# EAGLE design motor_controller_single (EAGLE 7.5.0)
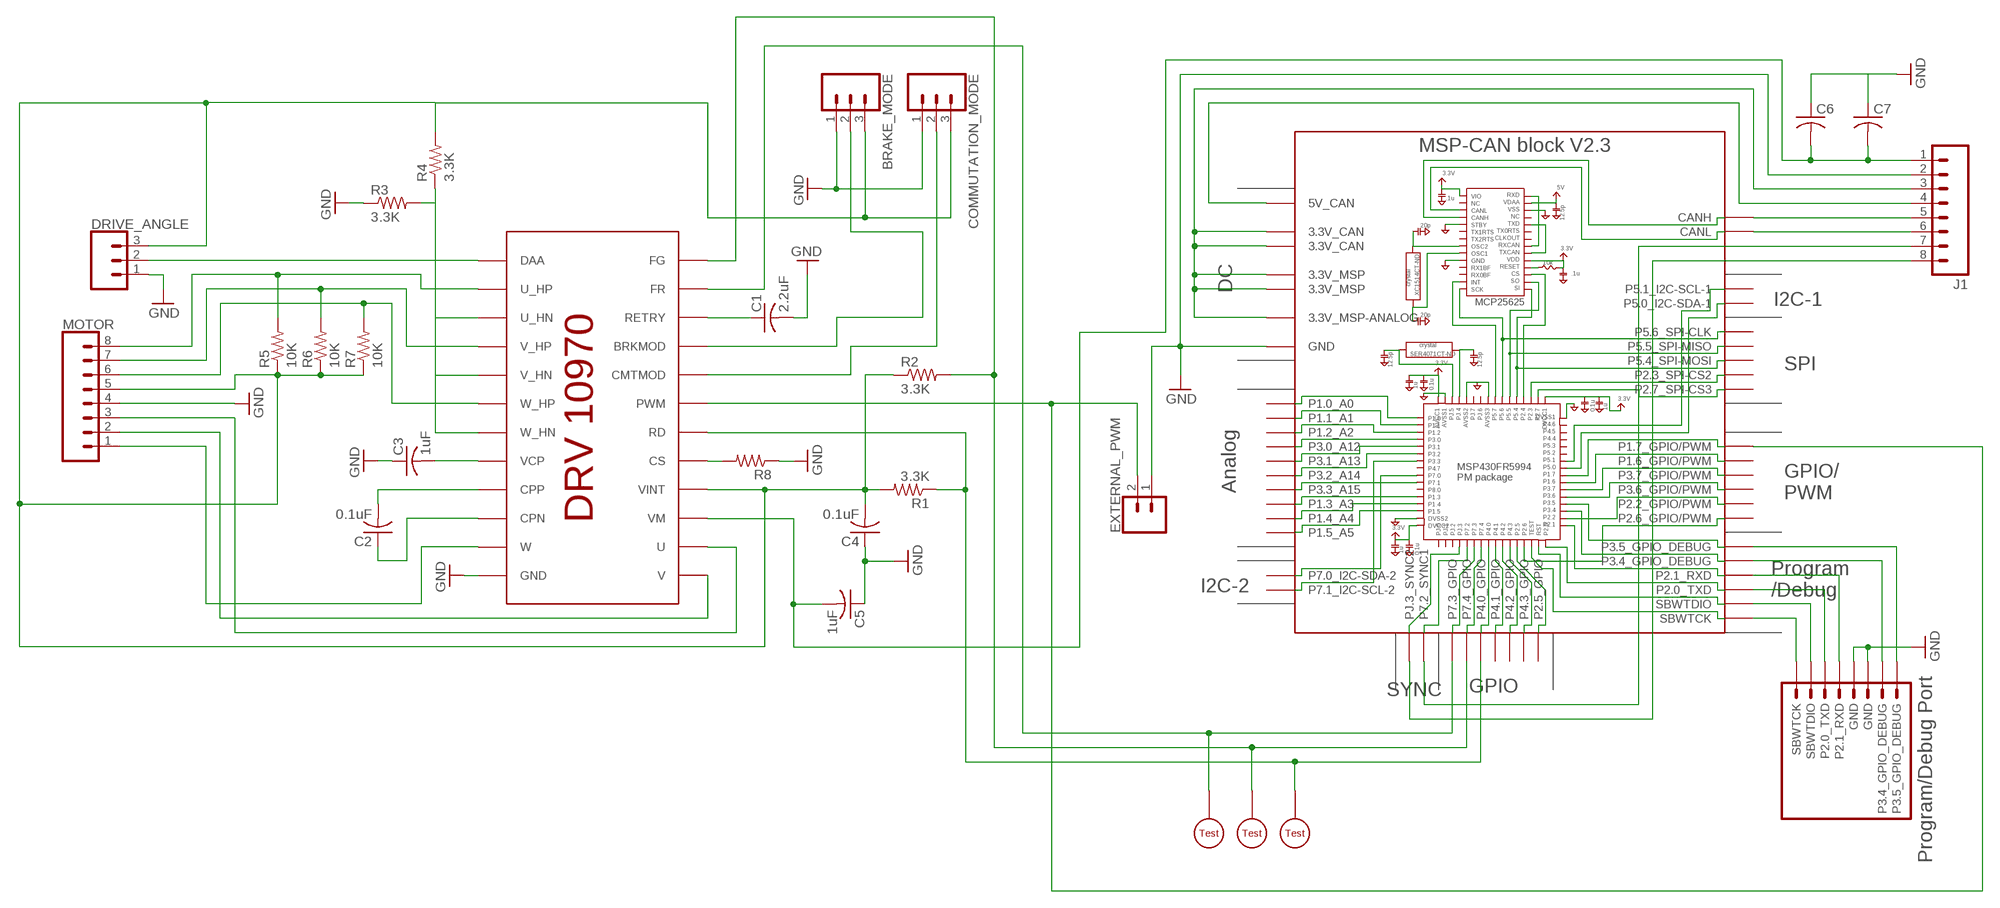
[diagram p0: schematic, sheet 1]

## Parts
BRAKE_MODE  CONN_03LOCK  [1X03_LOCK]
C1  2.2uF  C-USC1206  [C1206]
C2  0.1uF  C-USC0805  [C0805]
C3  1uF  C-USC1206  [C1206]
C4  0.1uF  C-USC0805  [C0805]
C5  1uF  C-USC1206  [C1206]
C6  C-USC0805  [C0805]
C7  C-USC0805  [C0805]
COMMUTATION_MODE  CONN_03LOCK  [1X03_LOCK]
DRIVE_ANGLE  CONN_03LOCK  [1X03_LOCK]
EXTERNAL_PWM  CONN_02LOCK  [1X02_LOCK]
J1  M08LOCK  [1X08_LOCK]
MOTOR  CONN_08"  [1X08@1]
R1  3.3K  R-US_R0805  [R0805]
R2  3.3K  R-US_R0805  [R0805]
R3  3.3K  R-US_R0805  [R0805]
R4  3.3K  R-US_R0805  [R0805]
R5  10K  R-US_R0805  [R0805]
R6  10K  R-US_R0805  [R0805]
R7  10K  R-US_R0805  [R0805]
R8  R-US_R0805  [R0805]
U$1  DRV10970  [DRV10970]
U$2  MSP-CAN_BLOCK  [MSP-CAN_BLOCK]
U$3  PROGRAM/DEBUG_PORT  [1X08_CONNECTOR]
U$4  KEYSTONE_SMD_TEST_POINT  [KEYSTONE_SMD_TEST_POINT]
U$5  KEYSTONE_SMD_TEST_POINT  [KEYSTONE_SMD_TEST_POINT]
U$6  KEYSTONE_SMD_TEST_POINT  [KEYSTONE_SMD_TEST_POINT]

## Nets
GND: BRAKE_MODE.1 C1.2 C3.1 C4.1 C5.1 C6.1 C7.1 COMMUTATION_MODE.1 DRIVE_ANGLE.1 EXTERNAL_PWM.1 J1.2 MOTOR.4 R3.1 R8.1 U$1.GND@1(GND) U$1.GND@2(GND) U$2.GND@1(GND) U$2.GND@2(GND) U$2.GND@3(GND) U$2.GND@4(GND) U$2.GND@5(GND) U$2.GND@7(GND) U$2.GND@8(GND) U$2.GND@9(GND) U$2.GND@10(GND) U$2.GND@11(GND) U$2.GND@12(GND) U$2.GND@13(GND) U$2.GND@14(GND) U$2.GND@15(GND) U$2.GND@16(GND) U$2.GND@17(GND) U$2.GND@26(GND) U$3.5(GND) U$3.6(GND)
N$1: C2.2 U$1.CPP
N$2: C1.1 U$1.RETRY
N$3: U$2.SBWTCK U$3.SBWTCK
N$4: U$2.SBWTDIO U$3.2(SBWTDIO)
N$5: U$2.P2.0_TXD U$3.3(P2.0_TXD)
N$6: U$2.P2.1_RXD U$3.4(P2.1_RXD)
N$7: U$2.P3.4_GPIO_DEBUG U$3.7(P3.4_GPIO_DEBUG)
N$8: U$2.P3.5_GPIO_DEBUG U$3.8(P3.5_GPIO_DEBUG)
N$9: R1.1 U$1.RD U$2.P4.0_GPIO U$6.P$1
N$10: EXTERNAL_PWM.2 U$1.PWM U$2.P1.7_GPIO/PWM
N$11: R2.2 U$1.FG U$2.P7.4_GPIO U$5.P$1
N$12: U$1.FR U$2.P7.3_GPIO U$4.P$1
N$13: C2.1 U$1.CPN
N$14: J1.6 U$2.CANL
N$15: C3.2 U$1.VCP
N$16: C5.2 C6.2 C7.2 J1.1 U$1.VM
N$17: R3.2 R4.1 U$1.U_HN U$1.V_HN U$1.W_HN
N$18: DRIVE_ANGLE.2 U$1.DAA
N$19: COMMUTATION_MODE.2 U$1.CMTMOD
N$20: BRAKE_MODE.2 U$1.BRKMOD
N$21: BRAKE_MODE.3 C4.2 COMMUTATION_MODE.3 DRIVE_ANGLE.3 MOTOR.5 R1.2 R2.1 R4.2 R5.1 R6.1 R7.1 U$1.VINT
N$22: J1.5 U$2.CANH
N$23: J1.4 U$2.5V(5V_CAN)
N$24: J1.3 U$2.3.3V@CAN1(3.3V_CAN) U$2.3.3V@CAN2(3.3V_CAN) U$2.3.3V@MSP1(3.3V_MSP) U$2.3.3V@MSP2(3.3V_MSP) U$2.3.3V_ANALOG@MSP2(3.3V_MSP-ANALOG)
N$25: R8.2 U$1.CS
N$26: MOTOR.1 U$1.W
N$27: MOTOR.6 R7.2 U$1.W_HP
N$28: MOTOR.7 R6.2 U$1.V_HP
N$29: MOTOR.8 R5.2 U$1.U_HP
N$30: MOTOR.2 U$1.V
N$34: MOTOR.3 U$1.U
SYNC1: J1.7 U$2.P7.2_SYNC1
SYNC2: J1.8 U$2.PJ.3_SYNC2
Unconnected: U$2.P1.0_A0 U$2.P1.1_A1 U$2.P1.2_A2 U$2.P1.3_A3 U$2.P1.4_A4 U$2.P1.5_A5 U$2.P1.6_GPIO/PWM U$2.P2.2_GPIO/PWM U$2.P2.4_SPI-CS2(P2.3_SPI-CS2) U$2.P2.5_GPIO U$2.P2.6_GPIO/PWM U$2.P2.7_SPI-CS3 U$2.P3.0_A12 U$2.P3.1_A13 U$2.P3.2_A14 U$2.P3.3_A15 U$2.P3.6_GPIO/PWM U$2.P3.7_GPIO/PWM U$2.P4.1_GPIO U$2.P4.2_GPIO U$2.P4.3_GPIO U$2.P5.0_I2C-SDA-1 U$2.P5.1_I2C-SCL-1 U$2.P5.4_SPI-MOSI U$2.P5.5_SPI-MISO U$2.P5.6_SPI-CLK U$2.P7.0_I2C-SDA-2 U$2.P7.1_I2C-SCL-2

## Library data of the parts
BRAKE_MODE COMMUTATION_MODE DRIVE_ANGLE = SparkFun-Connectors:CONN_03: Multi connection point. Often used as Generic Header-pin footprint for 0.1 inch spaced/style header connections On any of the 0.1 inch spaced packages, you can populate with these: Break Away Headers - Straight <https://www.sparkfun.com/products/116> (PRT-00116) Break Away Male Headers - Right Angle <https://www.sparkfun.com/products/553> (PRT-00553) Female Headers <https://www.sparkfun.com/products/115> (PRT-00115) Break Away Headers - Machine Pin <https://www.sparkfun.com/products/117> (PRT-00117) Break Away Female Headers - Swiss Machine Pin <https://www.sparkfun.com/products/743> (PRT-00743) Stackable Header - 3 Pin (Female, 0.1") <https://www.sparkfun.com/products/13875> (PRT-13875) For SCREWTERMINALS and SPRING TERMINALS visit here: Screw Terimnals on SparkFun.com <https://www.sparkfun.com/search/results?term=Screw+Terminals> (5mm/3.5mm/2.54mm spacing) This device is also useful as a general connection point to wire up your design to another part of your project. Our various solder wires solder well into these plated through hole pads. Hook-Up Wire - Assortment (Stranded, 22 AWG) <https://www.sparkfun.com/products/11375> (PRT-11375) Hook-Up Wire - Assortment (Solid Core, 22 AWG) <https://www.sparkfun.com/products/11367> (PRT-11367) View the entire wire category on our website here <https://www.sparkfun.com/categories/141> Special notes: Molex polarized connector foot print use with SKU : PRT-08232 with associated crimp pins and housings.
C1-C7 = rcl:C-US: CAPACITOR, American symbol
EXTERNAL_PWM = SparkFun-Connectors:CONN_02: Multi connection point. Often used as Generic Header-pin footprint for 0.1 inch spaced/style header connections On any of the 0.1 inch spaced packages, you can populate with these: Break Away Headers - Straight <https://www.sparkfun.com/products/116> (PRT-00116) Break Away Male Headers - Right Angle <https://www.sparkfun.com/products/553> (PRT-00553) Female Headers <https://www.sparkfun.com/products/115> (PRT-00115) Break Away Headers - Machine Pin <https://www.sparkfun.com/products/117> (PRT-00117) Break Away Female Headers - Swiss Machine Pin <https://www.sparkfun.com/products/743> (PRT-00743) For SCREWTERMINALS and SPRING TERMINALS visit here: Screw Terimnals on SparkFun.com <https://www.sparkfun.com/search/results?term=Screw+Terminals> (5mm/3.5mm/2.54mm spacing) This device is also useful as a general connection point to wire up your design to another part of your project. Our various solder wires solder well into these plated through hole pads. Hook-Up Wire - Assortment (Stranded, 22 AWG) <https://www.sparkfun.com/products/11375> (PRT-11375) Hook-Up Wire - Assortment (Solid Core, 22 AWG) <https://www.sparkfun.com/products/11367> (PRT-11367) View the entire wire category on our website here <https://www.sparkfun.com/categories/141> Special notes: Molex polarized connector foot print use with: PRT-08233 with associated crimp pins and housings. 2.54_SCREWTERM for use with PRT-10571. 3.5mm Screw Terminal footprints for PRT-08084 5mm Screw Terminal footprints for use with PRT-08432
J1 = SparkFun-Connectors:M08: Header 8 Standard 8-pin 0.1" header. Use with straight break away headers (SKU : PRT-00116), right angle break away headers (PRT-00553), swiss pins (PRT-00743), machine pins (PRT-00117), and female headers (PRT-00115).
MOTOR = SparkFun-Connectors:CONN_08: Multi connection point. Often used as Generic Header-pin footprint for 0.1 inch spaced/style header connections On any of the 0.1 inch spaced packages, you can populate with these: Break Away Headers - Straight <https://www.sparkfun.com/products/116> (PRT-00116) Break Away Male Headers - Right Angle <https://www.sparkfun.com/products/553> (PRT-00553) Female Headers <https://www.sparkfun.com/products/115> (PRT-00115) Break Away Headers - Machine Pin <https://www.sparkfun.com/products/117> (PRT-00117) Break Away Female Headers - Swiss Machine Pin <https://www.sparkfun.com/products/743> (PRT-00743) Arduino Stackable Header - 8 Pin <https://www.sparkfun.com/products/9279> (PRT-09279) For SCREWTERMINALS and SPRING TERMINALS visit here: Screw Terimnals on SparkFun.com <https://www.sparkfun.com/search/results?term=Screw+Terminals> (5mm/3.5mm/2.54mm spacing) This device is also useful as a general connection point to wire up your design to another part of your project. Our various solder wires solder well into these plated through hole pads. Hook-Up Wire - Assortment (Stranded, 22 AWG) <https://www.sparkfun.com/products/11375> (PRT-11375) Hook-Up Wire - Assortment (Solid Core, 22 AWG) <https://www.sparkfun.com/products/11367> (PRT-11367) View the entire wire category on our website here <https://www.sparkfun.com/categories/141> Special notes: Molex polarized connector foot print use with SKU : PRT-08231 with associated crimp pins and housings. 1MM SMD Version SKU: PRT-10208 NOTES ON THE VARIANTS LOCK and LOCK_LONGPADS... This footprint was designed to help hold the alignment of a through-hole component (i.e. 6-pin header) while soldering it into place. You may notice that each hole has been shifted either up or down by 0.005 of an inch from it's more standard position (which is a perfectly straight line). This slight alteration caused the pins (the squares in the middle) to touch the edges of the holes. Because they are alternating, it causes a "brace" to hold the component in place. 0.005 has proven to be the perfect amount of "off-center" position when using our standard breakaway headers. Although looks a little odd when you look at the bare footprint, once you have a header in there, the alteration is very hard to notice. Also,if you push a header all the way into place, it is covered up entirely on the bottom side.; PROD_ID: CONN-08438
R1-R8 = rcl:R-US_: RESISTOR, American symbol
U$1 = DubSat1 Components:DRV10970
U$2 = DubSat1 Components:MSP-CAN_BLOCK
U$3 = DubSat1 Components:PROGRAM/DEBUG_PORT
U$4-U$6 = DubSat1 Components:KEYSTONE_SMD_TEST_POINT

## Board
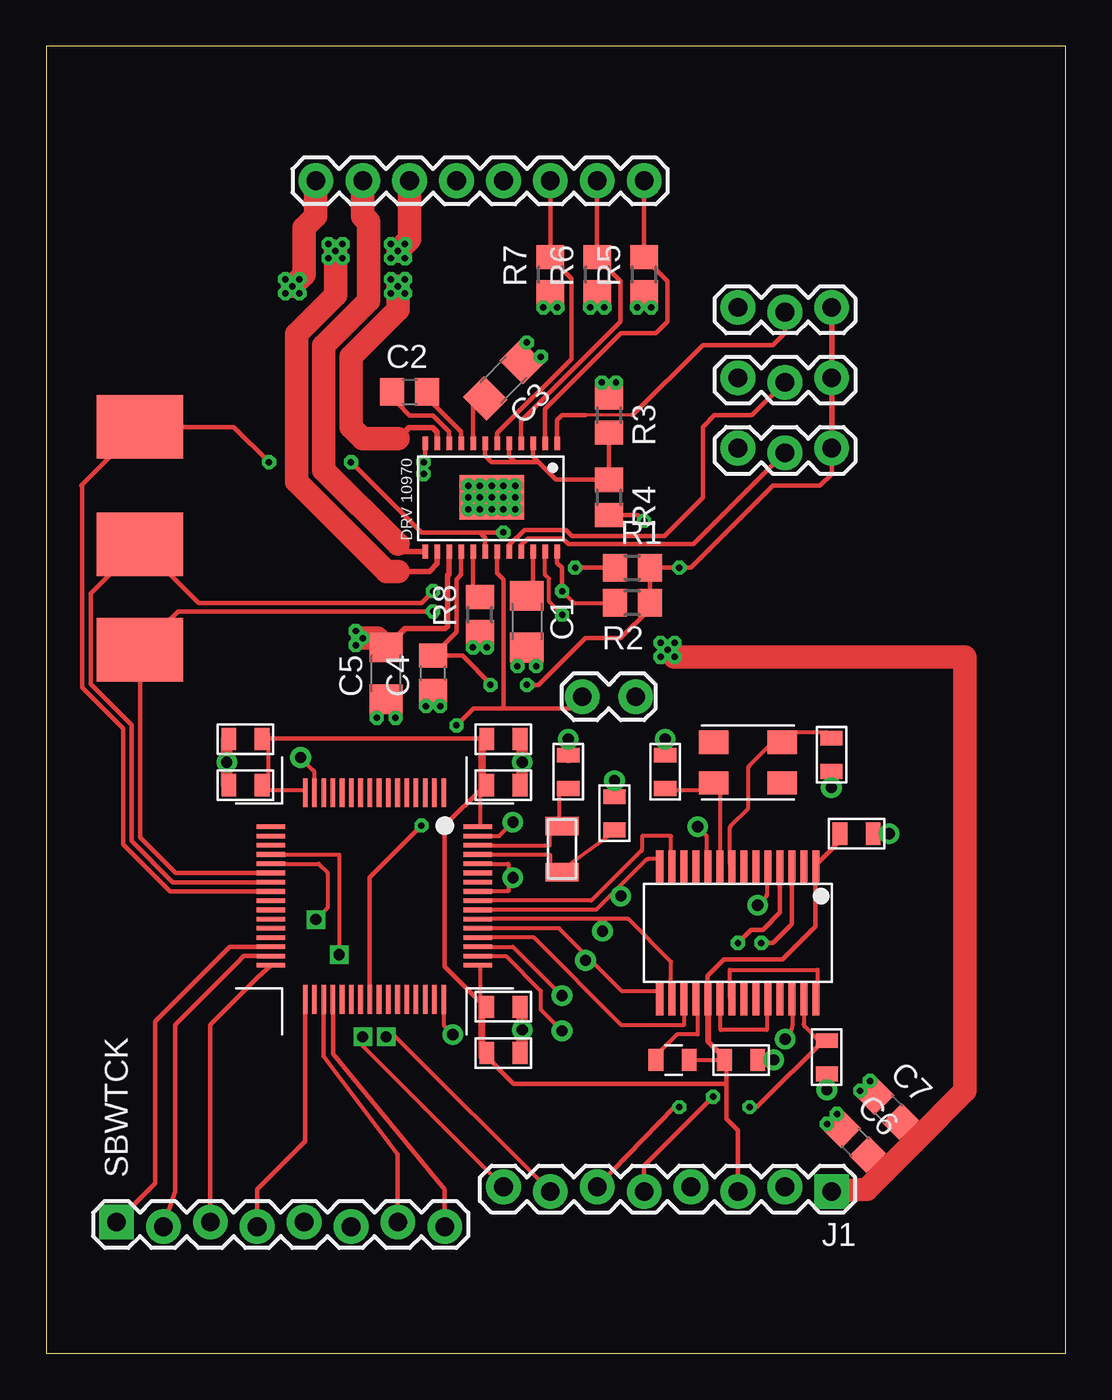
[diagram p1: board, top side]
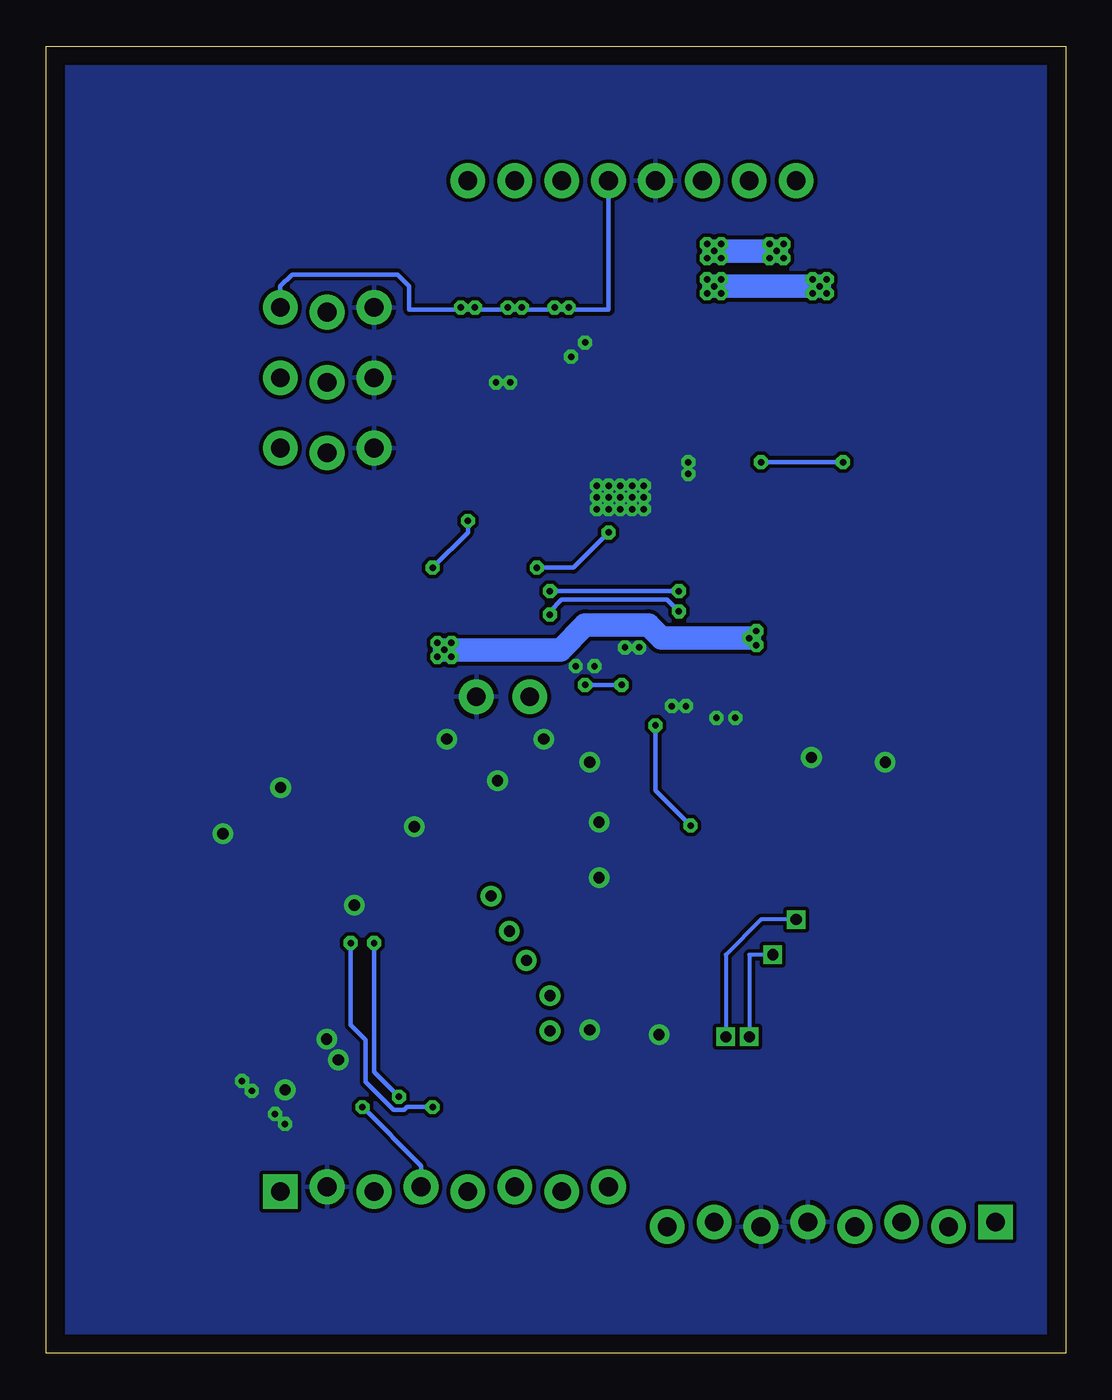
[diagram p2: board, bottom side, seen from below]

Size 55.23 x 70.79 mm. Coordinates in mm from the lower left corner, seen from the top.
Outline: 0,0 55.23,0 55.23,70.79 0,70.79 0,0
Copper layers (1*16): Top 0.035mm / dielectric 1.5mm / Bottom 0.035mm
Design rules "default *": minimum track width 6mil, minimum drill 0.35mm, track to track 8mil, track to pad 8mil, pad to pad 8mil, via to via 8mil, smd to smd 8mil, copper to edge 40mil, drill to drill 6mil, minimum pad ring 10mil, minimum via ring 8mil, stop-mask expansion 4mil, vias tented up to drill 0mil, thermal gap 10mil

### Footprints (pad centres in the part's own frame; a part is rotated, then mirrored left to right if it is on the bottom)
1X03_LOCK = drill 1.016 pad 1.88: 1 0,0.127; 2 2.54,-0.127; 3 5.08,0.127
C1206 = smd 1.6 x 1.8: 1 -1.4,0; 2 1.4,0
C0805 = smd 1.3 x 1.5: 1 -0.95,0; 2 0.95,0
1X02_LOCK = drill 1.016 pad 1.88: 1 -0.178,0; 2 2.718,0
1X08_LOCK = drill 1.016 pad 1.88 square: 1 0,0.127 | drill 1.016 pad 1.88: 2 2.54,-0.127; 3 5.08,0.127; 4 7.62,-0.127; 5 10.16,0.127; 6 12.7,-0.127; 7 15.24,0.127; 8 17.78,-0.127
1X08@1 = drill 1.016 pad 1.88: 1 0,0; 2 2.54,0; 3 5.08,0; 4 7.62,0; 5 10.16,0; 6 12.7,0; 7 15.24,0; 8 17.78,0
R0805 = smd 1.3 x 1.5: 1 -0.95,0; 2 0.95,0
DRV10970 = smd 0.3 x 0.75: BRKMOD -1.6,2.925; CMTMOD -0.95,2.925; CPN 2.3,-2.925; CPP 1.65,-2.925; CS 1,2.925; DAA -3.55,-2.925; FG -3.55,2.925; FR -2.9,2.925; GND@1 3.6,-2.925; PWM -0.3,2.925; RD 0.35,2.925; RETRY -2.25,2.925; U 2.95,2.925; U_HN -2.25,-2.925; U_HP -2.9,-2.925; V 3.6,2.925; V_HN -0.95,-2.925; V_HP -1.6,-2.925; VCP 1,-2.925; VINT 1.65,2.925; VM 2.3,2.925; W 2.95,-2.925; W_HN 0.35,-2.925; W_HP -0.3,-2.925 | smd 3.5 x 2.4: GND@2 0,0
MSP-CAN_BLOCK = smd 1.2 x 0.8: 1 -6,6.08; 2 -6,7.88; 3 -8.5,6.08; 4 -8.5,7.88; 9 -8.5,-6.08; 10 -8.5,-7.88; 11 -6,-6.08; 12 -6,-7.88; 13 8.5,6.08; 14 8.5,7.88; 15 6,6.08; 16 6,7.88; 23 8.875,18.955; 24 8.875,20.755; 25 8.875,17.045; 26 8.875,15.245; 27 -3.375,25.205; 28 -3.375,27.005 | smd 1 x 0.25: 3.3V@CAN1 -3.375,25.125; 3.3V@CAN2 8.875,18.875; 3.3V@MSP1 8.501,5.884; 3.3V@MSP2 -8.533,-5.962; 3.3V_ANALOG@MSP2 -8.482,5.904 | smd 0.8 x 1.2: 5 -5.83,10.5; 6 -7.63,10.5; 7 -3.58,13; 8 -5.38,13; 17 -8.545,24.75; 18 -6.745,24.75; 19 -5.83,15.75; 20 -7.63,15.75; 21 7.83,24.5; 22 9.63,24.5 | smd 0.25 x 1: 5V 7.65,24.5 | smd 1.75 x 0.4: CANH -1.6,21.96; CANL -1.6,22.61; P$65 -1.6,23.91; P$66 -1.6,23.26; P$69 -1.6,21.31; P$70 -1.6,20.66; P$71 -1.6,20.01; P$72 -1.6,19.36; P$73 -1.6,18.71; P$74 -1.6,18.06; P$75 -1.6,17.41; P$76 -1.6,16.76; P$77 -1.6,16.11; P$78 -1.6,15.46; P$79 5.6,15.46; P$80 5.6,16.11; P$81 5.6,16.76; P$82 5.6,17.41; P$83 5.6,18.06; P$84 5.6,18.71; P$85 5.6,19.36; P$86 5.6,20.01; P$87 5.6,20.66; P$88 5.6,21.31; P$89 5.6,21.96; P$90 5.6,22.61; P$91 5.6,23.26; P$92 5.6,23.91 | drill 0.61: GND@1 -3.375,27.875; GND@2 -5.875,24.75; GND@3 -3.75,17.5; GND@4 0.5,20.75; GND@5 -8.5,15.75; GND@7 -8.5,10.5; GND@8 -7.25,8; GND@9 -4,7.5; GND@10 -1,7.5; GND@11 7.75,22.25; GND@12 10.5,24.5; GND@13 8.875,21.625; GND@14 7.25,8; GND@15 7.5,4.25; GND@16 -7.5,-4; GND@17 -7.25,-8; GND@26 -6.25,13; P2.4_SPI-CS2 5.397,10.16; P2.7_SPI-CS3 7.303,10.16; P5.4_SPI-MOSI 3.487,11.434; P5.5_SPI-MISO 1.9,12.354; P5.6_SPI-CLK 0,13.348 | smd 1.55 x 0.25: P1.0_A0 -5.6,3.75; P1.1_A1 -5.6,3.25; P1.2_A2 -5.6,2.75; P1.3_A3 -5.6,-1.75; P1.4_A4 -5.6,-2.25; P1.5_A5 -5.6,-2.75; P1.6_GPIO/PWM 5.6,-0.75; P1.7_GPIO/PWM 5.6,-0.25; P2.1_RXD 5.6,-3.75; P2.2_GPIO/PWM 5.6,-3.25; P3.0_A12 -5.6,2.25; P3.1_A13 -5.6,1.75; P3.2_A14 -5.6,1.25; P3.3_A15 -5.6,0.75; P3.4_GPIO_DEBUG 5.6,-2.75; P3.5_GPIO_DEBUG 5.6,-2.25; P3.6_GPIO/PWM 5.6,-1.75; P3.7_GPIO/PWM 5.6,-1.25; P5.0_I2C-SDA-1 5.6,0.25; P5.1_I2C-SCL-1 5.6,0.75; P7.0_I2C-SDA-2 -5.6,-0.25; P7.1_I2C-SCL-2 -5.6,-0.75; P$8 -5.6,0.25; P$11 -5.6,-1.25; P$15 -5.6,-3.25; P$16 -5.6,-3.75; P$43 5.6,1.25; P$44 5.6,1.75; P$45 5.6,2.25; P$46 5.6,2.75; P$47 5.6,3.25; P$48 5.6,3.75 | smd 0.25 x 1.55: P2.0_TXD 3.75,-5.6; P2.5_GPIO 1.75,-5.6; P2.6_GPIO/PWM 2.25,-5.6; P4.0_GPIO -0.25,-5.6; P4.1_GPIO 0.25,-5.6; P4.2_GPIO 0.75,-5.6; P4.3_GPIO 1.25,-5.6; P7.2_SYNC1 -1.75,-5.6; P7.3_GPIO -1.25,-5.6; P7.4_GPIO -0.75,-5.6; P$17 -3.75,-5.6; P$18 -3.25,-5.6; P$19 -2.75,-5.6; P$49 3.75,5.6; P$50 3.25,5.6; P$51 2.75,5.6; P$52 2.25,5.6; P$53 1.75,5.6; P$54 1.25,5.6; P$55 0.75,5.6; P$56 0.25,5.6; P$57 -0.25,5.6; P$58 -0.75,5.6; P$59 -1.25,5.6; P$60 -1.75,5.6; P$61 -2.25,5.6; P$62 -2.75,5.6; P$63 -3.25,5.6; P$64 -3.75,5.6; PJ.3_SYNC2 -2.25,-5.6; SBWTCK 2.75,-5.6; SBWTDIO 3.25,-5.6 | smd 1 x 1.8: P$93 -3.79,10.16; P$94 -1.29,10.16 | smd 1.25 x 1.6: P$104 -6.13,18.38; P$105 -6.13,22.08; P$106 -8.33,22.08; P$107 -8.33,18.38
1X08_CONNECTOR = drill 1.016 pad 1.88: 2 2.54,-0.127; 3 5.08,0.127; 4 7.62,-0.127; 5 10.16,0.127; 6 12.7,-0.127; 7 15.24,0.127; 8 17.78,-0.127 | drill 1.016 pad 1.88 square: SBWTCK 0,0.127
KEYSTONE_SMD_TEST_POINT = smd 4.7 x 3.43: P$1 0,0

### Placement (x,y rotation side)
BRAKE_MODE  37.47,48.9 0 top
C1  26.04,39.62 270 top
C2  19.68,52.07 0 top
C3  24.77,52.7 225 top
C4  20.95,36.83 90 top
C5  18.41,36.83 90 top
C6  43.81,11.43 315 top
C7  45.61,13.23 315 top
COMMUTATION_MODE  37.47,52.7 0 top
DRIVE_ANGLE  37.47,56.52 0 top
EXTERNAL_PWM  31.75,35.56 180 top
J1  42.55,8.89 180 top
MOTOR  14.61,63.5 0 top
R1  31.75,42.55 0 top
R2  31.75,40.64 180 top
R3  30.48,50.8 270 top
R4  30.48,46.36 270 top
R5  32.38,58.42 90 top
R6  29.84,58.42 90 top
R7  27.3,58.42 90 top
R8  23.5,40.01 90 top
U$1  24.13,46.36 180 top
U$2  17.78,24.77 270 top
U$3  3.81,6.99 0 top
U$4  5.08,38.1 0 top
U$5  5.08,43.81 0 top
U$6  5.08,50.16 0 top

### Tracks (layer width: path | path; a pad name or v marks a point on that pad's centre or on a via)
GND  (via drill 0.35)
  Top 0.254: U$1.GND@1 20.53,48.34 v20.45,48.26 | v30.1,52.58 30.1,52.13 R3.1 30.86,52.13 v30.86,52.58 | v17.91,34.42 17.91,34.92 18.36,35.38 | 18.36,35.38 C5.1 | v18.92,34.42 18.92,34.82 18.36,35.38 | v20.57,35.05 20.57,35.5 20.81,35.74 | 20.81,35.74 C4.1 | v21.34,35.05 21.34,35.22 20.81,35.74 | v23.11,38.23 23.11,38.67 23.4,38.96 | 23.4,38.96 R8.1 | v23.88,38.23 23.88,38.48 23.4,38.96 | v44.08,14.21 44.4,13.9 44.79,13.9 | 44.79,13.9 C7.1 | v44.62,14.75 44.79,14.58 44.79,13.9 | v42.83,12.96 43.14,12.64 C6.1 | C6.1 | v42.29,12.42 42.6,12.11 C6.1 | v26.04,54.74 26.04,53.98 | v26.8,53.98 26.04,53.98 | 26.04,53.98 C3.1 | 26.04,37.72 v25.53,37.21 | C1.2 26.04,37.72 | 26.04,37.72 v26.54,37.21
  other vias: 24.13,46.36 22.86,46.99 24.13,46.99 23.5,46.99 24.77,46.99 25.4,46.99 25.4,46.36 24.77,46.36 23.5,46.36 22.86,46.36 22.86,45.72 23.5,45.72 24.13,45.72 24.77,45.72 25.4,45.72 20.45,47.62
  pour Bottom: 0,-1.27 55.24,-1.27 55.24,70.48 0,70.48
N$1
  Top 0.254: U$1.CPP 22.48,49.91 22.29,50.1 22.29,50.11 21.78,50.62 21.77,50.62 20.95,51.44 C2.2
N$2
  Top 0.254: U$1.RETRY 26.38,41.37 C1.1
N$3
  Top 0.254: U$3.SBWTCK 5.89,9.2 5.89,17.98 9.93,22.02 U$2.SBWTCK
N$4
  Top 0.254: U$2.SBWTDIO 10.71,21.52 10.34,21.14 10.34,21.13 6.99,17.78 6.99,8.76 U$3.2
N$5
  Top 0.254: U$2.P2.0_TXD 11.49,20.38 8.89,17.78 U$3.3
N$6
  Top 0.254: U$2.P2.1_RXD 14.03,11.49 11.43,8.89 U$3.4
N$7
  Top 0.254: U$2.P3.4_GPIO_DEBUG 15.03,16.07 19.04,10.79 U$3.7
N$8
  Top 0.254: U$2.P3.5_GPIO_DEBUG 15.53,16.22 21.59,8.89 U$3.8
N$9  (via drill 0.35)
  Top 0.254: U$2.P4.0_GPIO 6.71,25.02 4.17,27.56 4.17,33.84 1.94,36.06 1.94,46.95 1.91,46.99 U$6.P$1 10.16,50.16 v12.06,48.26 | v16.51,48.26 20.32,44.45 23.5,44.45 | 23.5,44.45 23.78,44.16 U$1.RD | 23.5,44.45 v24.76,44.45 | v28.65,42.55 R1.1
  Bottom 0.254: v12.06,48.26 v16.51,48.26 | v24.76,44.45 26.67,42.55 v28.65,42.55
N$10  (via drill 0.35)
  Top 0.254: U$1.PWM 24.43,42.25 24.77,41.91 24.77,34.93 | 24.77,34.93 23.14,34.93 v22.23,34.01 | v20.32,28.58 17.53,25.79 U$2.P1.7_GPIO/PWM | EXTERNAL_PWM.2 28.4,34.93 24.77,34.93
  Bottom 0.254: v22.23,34.01 22.23,30.48 v20.32,28.58
N$11  (via drill 0.35)
  Top 0.203: v27.94,41.27 28.57,40.64 R2.2
  Top 0.254: U$2.P7.4_GPIO 6.86,25.52 4.62,27.75 4.62,34.02 2.4,36.25 2.4,41.13 U$5.P$1 8.26,40.64 20.32,40.64 v20.95,41.27 | v27.94,41.27 27.94,42.55 27.68,42.8 U$1.FG
  Bottom 0.254: v20.95,41.27 v27.94,41.27
N$12  (via drill 0.35)
  Top 0.203: v27.94,40.01 27.24,40.7 27.24,41.95 27.03,42.16 U$1.FR
  Top 0.254: U$2.P7.3_GPIO 7,26.02 5.08,27.94 U$4.P$1 7.16,40.18 v20.95,40.18
  Bottom 0.254: v20.95,40.18 21.59,40.82 27.3,40.82 27.94,40.18 v27.94,40.01
N$13
  Top 0.254: U$1.CPN 21.83,49.93 21.59,50.16 21.58,50.16 20.95,50.79 19.69,50.79 19.05,51.44 19.05,51.76 C2.1
N$14  (via drill 0.35)
  Top 0.254: U$2.CANL 40.39,23.25 39.37,22.23 v38.73,22.23 | v34.29,13.33 34.04,13.33 J1.6
  Bottom 0.254: v38.73,22.23 38.73,17.78 37.92,16.97 37.92,14.69 36.41,13.19 35.83,13.19 35.68,13.33 v34.29,13.33
N$15
  Top 0.254: U$1.VCP 23.13,51.7 C3.2
N$16  (via drill 0.35)
  Top 0.254: v33.27,38.48 v33.66,38.1 | v33.66,38.1 v34.04,38.48 | v33.66,38.1 v33.27,37.72 | v33.66,38.1 v34.04,37.72 | v16.76,38.35 v17.14,38.73 v16.76,39.12
  Top 0.305: U$1.VM 21.83,42.2 21.74,42.11 21.74,39.37 21.61,39.24 19.43,39.24 C5.2
  Top 1.27: v34.04,37.72 34.06,37.7 49.76,37.7 49.76,14.2 46.99,11.43 | v17.14,38.73 17.91,38.73 C5.2 | J1.1 44.45,8.89 45.4,9.84 | 45.4,9.84 46.99,11.43 | 45.4,9.84 C6.2 | 46.99,11.43 46.99,11.85 C7.2
  Bottom 1.27: v33.66,38.1 27.37,38.1 26.03,39.44 22.61,39.44 21.9,38.73 v17.14,38.73
N$17
  Top 0.254: 26.67,48.26 27.62,47.3 R4.1 R3.2 | 26.67,48.26 25.4,48.26 | 25.4,48.26 24.13,48.26 23.78,48.61 U$1.W_HN | 26.67,48.26 26.38,48.55 U$1.U_HN | 25.4,48.26 25.08,48.58 U$1.V_HN
N$18
  Top 0.152: 31.75,50.8 29.21,50.8
  Top 0.254: U$1.DAA 27.68,50.54 27.94,50.8 29.21,50.8 | DRIVE_ANGLE.2 40.01,55.25 39.37,54.61 35.56,54.61 31.75,50.8
N$19
  Top 0.254: U$1.CMTMOD 25.08,43.77 25.9,44.59 28.16,44.59 28.48,44.27 33.48,44.27 35.56,46.36 35.56,50.16 36.2,50.8 38.23,50.8 COMMUTATION_MODE.2
N$20
  Top 0.254: U$1.BRKMOD 25.73,43.77 26.09,44.13 27.97,44.13 28.29,43.81 35.05,43.81 BRAKE_MODE.2
N$21  (via drill 0.35)
  Top 0.254: v26.92,56.64 26.92,57.09 R7.1 27.69,57.09 v27.69,56.64 | v29.46,56.64 29.46,57.09 R6.1 30.23,57.09 v30.23,56.64 | v32,56.64 32,57.09 R5.1 32.77,57.09 v32.77,56.64 | U$1.VINT 22.48,42.16 22.23,41.91 22.23,39.05 C4.2 22.55,37.78 24.13,36.2 v24.06,36.2 | R4.2 32.06,45.41 v32.38,45.09 | BRAKE_MODE.3 42.55,47.62 41.91,46.99 39.37,46.99 34.92,42.55 v34.29,42.55 R1.2 R2.1 32.7,40.32 31.11,38.73 29.21,38.73 26.67,36.2 v26.04,36.2
  Top 0.305: BRAKE_MODE.3 COMMUTATION_MODE.3 DRIVE_ANGLE.3
  Bottom 0.254: MOTOR.5 24.77,56.52 27.56,56.52 | 29.34,56.52 27.56,56.52 | 30.1,56.52 29.34,56.52 | 32.13,56.52 30.1,56.52 | 32.89,56.52 32.13,56.52 | 32.89,56.52 35.56,56.52 35.56,57.79 36.2,58.42 41.91,58.42 42.55,57.79 DRIVE_ANGLE.3 | v27.69,56.64 27.56,56.52 | v29.46,56.64 29.34,56.52 | v30.23,56.64 30.1,56.52 | v32,56.64 32.13,56.52 | v32.77,56.64 32.89,56.52 | v32.38,45.09 32.38,44.45 v34.29,42.55 | v24.06,36.2 v26.04,36.2
N$22  (via drill 0.35)
  Top 0.254: U$2.CANH 39.74,23.87 38.81,22.93 38.17,22.93 v37.47,22.23 | v36.12,13.9 32.38,10.16 J1.5
  Bottom 0.254: v37.47,22.23 37.47,15.24 v36.12,13.9
N$23  (via drill 0.35)
  Top 0.254: U$2.5V 38.5,13.33 v38.1,13.33
  Bottom 0.254: v38.1,13.33 34.92,10.16 J1.4
N$24
  Top 0.254: U$2.3.3V@MSP2 23.63,33.3 U$2.3.3V_ANALOG@MSP2 23.68,30.67 21.59,28.58 21.59,20.96 23.66,18.88 U$2.3.3V@MSP1 25.32,14.6 36.77,14.6 36.83,14.54 | 36.7,15.85 U$2.3.3V@CAN2 | 36.7,15.85 36.83,15.71 36.83,14.54 | 36.83,14.54 36.83,12.7 37.47,12.06 J1.3 | U$2.3.3V@CAN1 42.91,27.67 41.66,26.42 41.66,23.11 39.88,21.34 36.7,21.34 35.81,20.45 35.81,16.89 36.7,16.01 36.7,15.85
N$25
  Top 0.254: R8.2 23.13,41.32 U$1.CS
N$26  (via drill 0.35)
  Top 0.254: v12.95,58.17 v13.34,57.79 | 13.31,57.76 v12.95,57.4 | 13.31,57.76 v13.34,57.79 | v13.72,58.17 v13.34,57.79 | v13.72,57.4 13.66,57.4 13.31,57.76 | v19.04,57.79 v18.67,58.17 | v19.04,57.79 v19.05,57.79 18.95,57.68 | 18.95,57.68 v18.67,57.4 | v19.43,57.4 19.23,57.4 18.95,57.68 | v19.43,58.17 19.42,58.17 v19.04,57.79
  Top 0.305: U$1.W 21.18,49.88 20.93,50.13 19.66,50.13 19.05,49.53
  Top 1.27: 19.05,49.53 17.14,49.53 16.51,50.16 16.51,53.98 19.05,56.52 v19.05,57.79 | v13.34,57.79 13.97,58.42 13.97,60.96 14.61,61.59 MOTOR.1
  Bottom 1.27: v19.05,57.79 v13.34,57.79
N$27
  Top 0.254: MOTOR.6 R7.2 27.3,59.34 28.45,58.19 28.45,53.85 24.43,49.83 U$1.W_HP
N$28
  Top 0.254: MOTOR.7 R6.2 29.84,59.34 31.11,58.07 31.11,55.87 25.73,50.48 U$1.V_HP
N$29
  Top 0.254: MOTOR.8 R5.2 32.38,59.34 33.66,58.07 33.66,55.88 33.02,55.25 31.14,55.25 27.03,51.14 U$1.U_HP
N$30
  Top 0.305: 19.05,43.81 19.43,43.43 U$1.V
  Top 1.27: 19.05,43.81 15.04,47.83 15.04,54.59 17.45,57 17.45,61.29 17.14,61.59 MOTOR.2
N$34  (via drill 0.35)
  Top 0.254: 19,59.64 v18.67,59.31 | 19,59.64 v19.05,59.69 v19.43,60.07 | v19.43,59.31 19.33,59.31 19.08,59.56 | 19.08,59.56 19,59.64 | v18.67,60.07 18.67,59.97 19.08,59.56 | v16.05,60.07 v15.67,59.69 | v15.29,60.07 v15.67,59.69 | v15.29,59.31 v15.67,59.69 | v16.05,59.31 v15.67,59.69
  Top 0.305: 19.05,42.34 20.75,42.34 21.18,42.77 U$1.U
  Top 1.27: 19.05,42.34 18.44,42.34 13.56,47.22 13.56,55.2 15.67,57.3 v15.67,59.69 | v19.05,59.69 19.68,60.33 MOTOR.3
  Bottom 1.27: v15.67,59.69 v19.05,59.69
SYNC1  (via drill 0.6)
  Top 0.203: U$2.P7.2_SYNC1 14.76,26.52 15.24,26.04 15.24,24.13 v14.61,23.5 | v18.41,17.14 18.92,17.14 J1.7
  Bottom 0.203: v14.61,23.5 16.51,23.5 18.41,21.59 v18.41,17.14
SYNC2  (via drill 0.6)
  Top 0.203: U$2.PJ.3_SYNC2 15.88,27.02 v15.88,21.59 | v17.14,17.14 17.14,16.64 J1.8
  Bottom 0.203: v15.88,21.59 17.14,21.59 v17.14,17.14

### Text on the board
tDocu: W | V | U | GND | V_H | H_W | H_V | H_U | LO | HI | DRV_MOD | COM_MOD | RD | BRK_MOD | FG | FR | EXT_PWM (SIG | GND) | SYNC2 | SYNC1 | CANL | CANH | 5V | 3v3 | GND | V_M